# Altium schematic sheet 15-I2C-EPPROM.SchDoc
size A
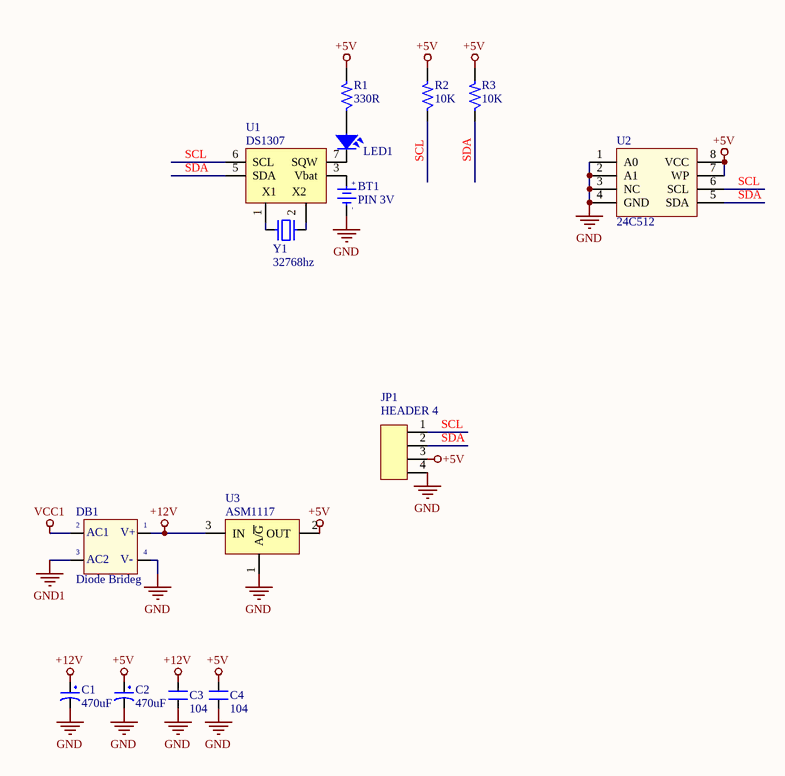
[diagram p0: 15-I2C-EPPROM.SchDoc]

## Parts
BT1  PIN 3V  [SK-BATT-CR1220]
C1  470uF  [C-ALU-D6.5]
C2  470uF  [C-ALU-D6.5]
C3  104  [C-0805]
C4  104  [C-0805]
DB1  Diode Brideg  [D-DB-1A-SMD]
JP1  HEADER 4  [JP4]
LED1  LED  [LED-3]  (value not drawn)
R1  330R  [R-0805]
R2  10K  [R-0805]
R3  10K  [R-0805]
U1  DS1307  [SO-8-DS1307]
U2  24C512  [SO-8-24C64]
U3  ASM1117  [TO-252]
Y1  32768hz  [XTAL-AB38T-SMD]

## Nets
+5V: C2.1 C4.2 JP1.3 R1.2 R2.2 R3.2 U1.8(+5V) U2.7(WP) U2.8(VCC) U3.2(OUT)
+12V: C1.1 C3.2 DB1.3(AC2) U3.3(IN)
GND: BT1.2(GND) C1.2 C2.2 C3.1 C4.1 DB1.4(-V_OUT) JP1.4 U1.4(GND) U2.1(A0) U2.2(A1) U2.3(NC) U2.4(GND) U3.1(A/~{G})
GND1: DB1.1(+V_OUT)
VCC1: DB1.2(AC1)
SCL: JP1.1 R2.1 U1.6(SCL) U2.6(SCL)
SDA: JP1.2 R3.1 U1.5(SDA) U2.5(SDA)
NetBT1_1: BT1.1(+3V) U1.3(Vbat)
NetLED1_1: LED1.1 R1.1
NetLED1_2: LED1.2 U1.7(SQW)
NetU1_1: U1.1(X1) Y1.1
NetU1_2: U1.2(X2) Y1.2

## Notes on the sheet
- (in symbol DB) V+; V-
- (in symbol PIN 3V) +; -

## Library data of the parts
BT1 = PIN 3V: Battery 3VDC; Value: PIN 3V
C1 C2 = CP1: Cap P  0,1uF < 22uF , 16 - 50V; Value: 10uF/50V; Description 1: 10 => 220uF/6,3V/10V - 10uF => 100uF/16V; Description 2: 0,1uF => 33uF/50V - 10uF => 22uF/63V; Description 3: 0,47uF => 10uF/100V
C3 C4 = CN: Value: 0,1uF/300V; Designed by: VanDungEvn
DB1 = DB: Convert AC to DC voltage, 4 pin; Value: Cau 1A
JP1 = JP4
LED1 = LED: LED Single colour Green and Red; Value: LED 3 ly Single Colour
R1-R3 = R: Resistor 1/4W; Value: R1/4W - 1K
U1 = DS1307: Real Timer Serial; Value: DS1307
U2 = 24Cxx: Standard 2-Wire Bus Interface Serial EEPROM; Value: 24Cxx; Value: DIP 8; Copyright by: VanDungEvn
Y1 = XT2: Crystal For all Crystal 2pin.; Value: 4Mhz